# Altium project FET_Driver.PrjPcb (part 1 of 3)
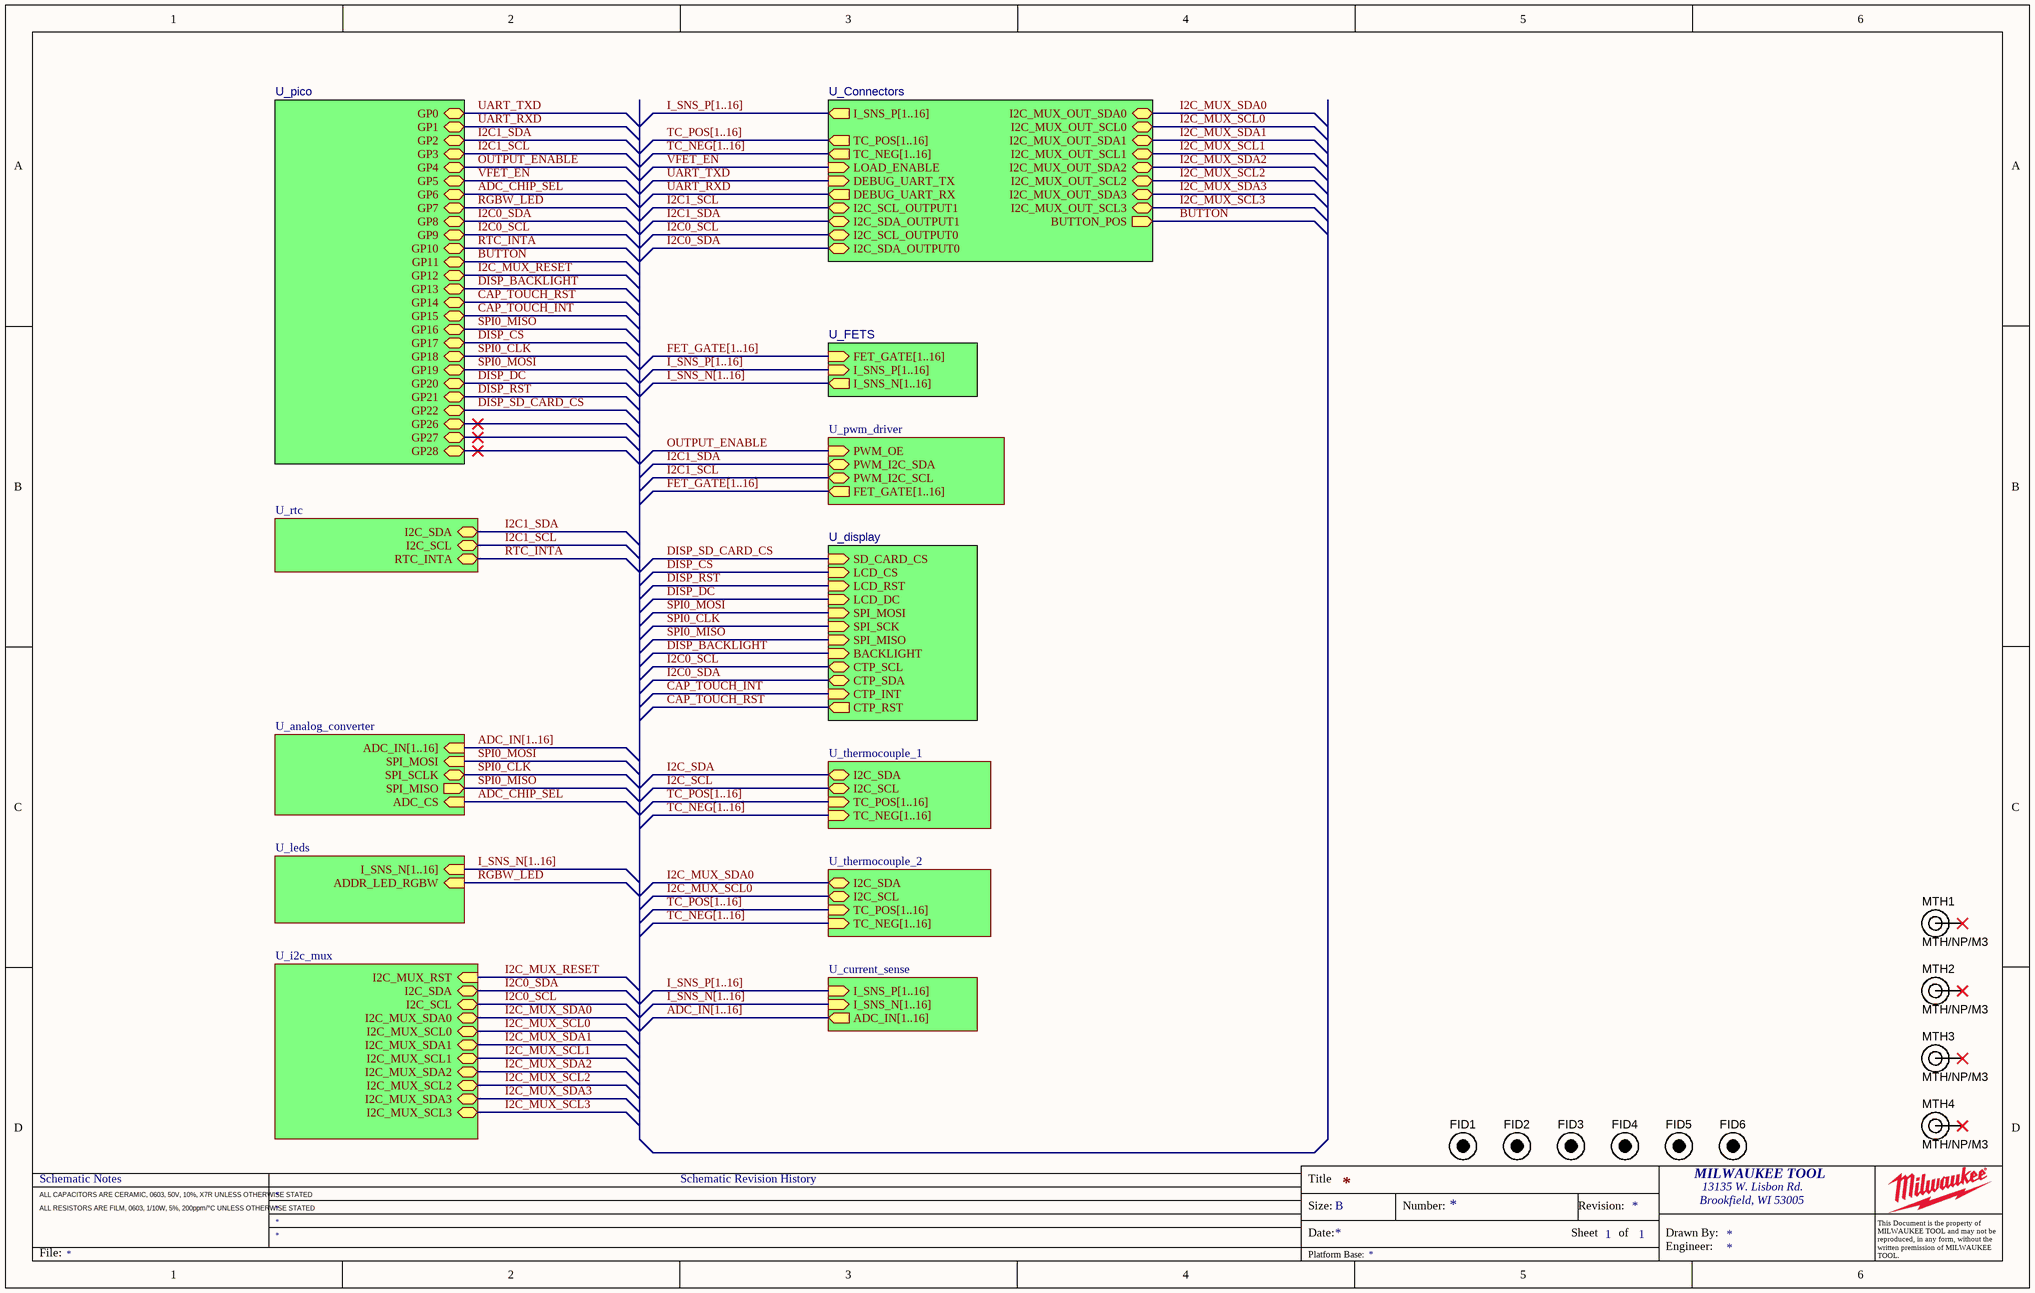
[diagram p0: TopSheet.SchDoc]
projectSheetTotal: sch sheet total; projectName: project name; projectDrawnBy: enter name; projectCreatedDate: enter date; projectApprovedDate: enter date; projectApprovedBy: enter name; pcbRevision: A; pcbNumber: 806xxx; pcbDescriptionLine2: enter description; pcbDescriptionLine1: enter description; pcbDescription: enter description; pcaRevision: A; pcaNumber: 840xxx; pcaDesctiption: enter description; pcaDescriptionLine2: enter description; pcaDescriptionLine1: enter description; bomNotes: -; bomCreatedDate: enter date
13 sheets, 608 parts. Net scope: hierarchical (ports join the sheet entries above them; power ports are global).
Board file: main.PcbDoc
Sheets:
  TopSheet.SchDoc
    U_pico = pico.SchDoc
    U_Connectors = Connectors.SchDoc
    U_leds = leds.SchDoc
    U_i2c_mux = i2c_mux.SchDoc
    U_analog_converter = analog_converter.SchDoc
    U_display = display.SchDoc
    U_thermocouple_1 = thermocouple_1.SchDoc
    U_thermocouple_2 = thermocouple_2.SchDoc
    U_current_sense = current_sense.SchDoc
    U_pwm_driver = pwm_driver.SchDoc
    U_FETS = FETS.SchDoc
    U_rtc = rtc.SchDoc

## Sheet TopSheet.SchDoc
size B; Address1: MILWAUKEE TOOL; Address2: 13135 W. Lisbon Rd.; Address3: Brookfield, WI 53005; SheetNumber: 1; SheetTotal: 1

### Parts
FID1  FIDUCIAL STANDARD  [FID]  (value not drawn)  (no BOM)
FID2  FIDUCIAL STANDARD  [FID]  (value not drawn)  (no BOM)
FID3  FIDUCIAL STANDARD  [FID]  (value not drawn)  (no BOM)
FID4  FIDUCIAL STANDARD  [FID]  (value not drawn)  (no BOM)
FID5  FIDUCIAL STANDARD  [FID]  (value not drawn)  (no BOM)
FID6  FIDUCIAL STANDARD  [FID]  (value not drawn)  (no BOM)
MTH1  MTH/NP/M3  [MTGNP700H325Z700P]  (no BOM)
MTH2  MTH/NP/M3  [MTGNP700H325Z700P]  (no BOM)
MTH3  MTH/NP/M3  [MTGNP700H325Z700P]  (no BOM)
MTH4  MTH/NP/M3  [MTGNP700H325Z700P]  (no BOM)

### Sub-sheets
U_analog_converter = analog_converter.SchDoc: ADC_IN[1..16] (in), SPI_MISO (out), SPI_MOSI (in), SPI_SCLK (bidir), ADC_CS (in)
U_Connectors = Connectors.SchDoc: DEBUG_UART_TX (in), DEBUG_UART_RX (out), I2C_SCL_OUTPUT1 (bidir), I2C_SDA_OUTPUT1 (bidir), LOAD_ENABLE (in), I_SNS_P[1..16] (out), TC_POS[1..16] (out), TC_NEG[1..16] (out), I2C_MUX_OUT_SDA0 (bidir), I2C_MUX_OUT_SCL0 (bidir), I2C_MUX_OUT_SDA1 (bidir), I2C_MUX_OUT_SCL1 (bidir), I2C_MUX_OUT_SDA2 (bidir), I2C_MUX_OUT_SCL2 (bidir), I2C_MUX_OUT_SDA3 (bidir), I2C_MUX_OUT_SCL3 (bidir), BUTTON_POS (out), I2C_SDA_OUTPUT0 (bidir), I2C_SCL_OUTPUT0 (bidir)
U_current_sense = current_sense.SchDoc: ADC_IN[1..16] (out), I_SNS_P[1..16] (in), I_SNS_N[1..16] (in)
U_display = display.SchDoc: LCD_CS (in), LCD_RST (in), LCD_DC (in), SPI_MOSI (in), SPI_SCK (in), BACKLIGHT (in), SPI_MISO (in), CTP_SCL (bidir), CTP_RST (out), CTP_SDA (bidir), CTP_INT (in), SD_CARD_CS (in)
U_FETS = FETS.SchDoc: FET_GATE[1..16] (in), I_SNS_N[1..16] (out), I_SNS_P[1..16] (in)
U_i2c_mux = i2c_mux.SchDoc: I2C_SDA (bidir), I2C_SCL (bidir), I2C_MUX_SDA0 (bidir), I2C_MUX_SDA1 (bidir), I2C_MUX_SDA2 (bidir), I2C_MUX_SDA3 (bidir), I2C_MUX_SCL0 (bidir), I2C_MUX_SCL1 (bidir), I2C_MUX_SCL2 (bidir), I2C_MUX_SCL3 (bidir), I2C_MUX_RST (in)
U_leds = leds.SchDoc: I_SNS_N[1..16] (in), ADDR_LED_RGBW (in)
U_pico = pico.SchDoc: GP0 (bidir), GP1 (bidir), GP2 (bidir), GP3 (bidir), GP4 (bidir), GP5 (bidir), GP6 (bidir), GP7 (bidir), GP8 (bidir), GP9 (bidir), GP10 (bidir), GP11 (bidir), GP12 (bidir), GP13 (bidir), GP14 (bidir), GP15 (bidir), GP16 (bidir), GP17 (bidir), GP18 (bidir), GP19 (bidir), GP20 (bidir), GP21 (bidir), GP22 (bidir), GP26 (bidir), GP27 (bidir), GP28 (bidir)
U_pwm_driver = pwm_driver.SchDoc: PWM_OE (in), PWM_I2C_SDA (bidir), PWM_I2C_SCL (bidir), FET_GATE[1..16] (out)
U_rtc = rtc.SchDoc: I2C_SDA (bidir), I2C_SCL (bidir), RTC_INTA (bidir)
U_thermocouple_1 = thermocouple_1.SchDoc: I2C_SDA (bidir), I2C_SCL (bidir), TC_POS[1..16] (in), TC_NEG[1..16] (in)
U_thermocouple_2 = thermocouple_2.SchDoc: I2C_SDA (bidir), I2C_SCL (bidir), TC_POS[1..16] (in), TC_NEG[1..16] (in)

### Nets
ADC_CHIP_SEL: sheet U_pico/GP6, sheet U_analog_converter/ADC_CS
BUTTON: sheet U_pico/GP11, sheet U_Connectors/BUTTON_POS
CAP_TOUCH_INT: sheet U_pico/GP15, sheet U_display/CTP_INT
CAP_TOUCH_RST: sheet U_pico/GP14, sheet U_display/CTP_RST
DISP_BACKLIGHT: sheet U_pico/GP13, sheet U_display/BACKLIGHT
DISP_CS: sheet U_pico/GP17, sheet U_display/LCD_CS
DISP_DC: sheet U_pico/GP20, sheet U_display/LCD_DC
DISP_RST: sheet U_pico/GP21, sheet U_display/LCD_RST
DISP_SD_CARD_CS: sheet U_pico/GP22, sheet U_display/SD_CARD_CS
I2C0_SCL: sheet U_pico/GP9, sheet U_Connectors/I2C_SCL_OUTPUT0, sheet U_i2c_mux/I2C_SCL, sheet U_display/CTP_SCL
I2C0_SDA: sheet U_pico/GP8, sheet U_Connectors/I2C_SDA_OUTPUT0, sheet U_i2c_mux/I2C_SDA, sheet U_display/CTP_SDA
I2C1_SCL: sheet U_pico/GP3, sheet U_Connectors/I2C_SCL_OUTPUT1, sheet U_pwm_driver/PWM_I2C_SCL, sheet U_rtc/I2C_SCL
I2C1_SDA: sheet U_pico/GP2, sheet U_Connectors/I2C_SDA_OUTPUT1, sheet U_pwm_driver/PWM_I2C_SDA, sheet U_rtc/I2C_SDA
I2C_MUX_RESET: sheet U_pico/GP12, sheet U_i2c_mux/I2C_MUX_RST
I2C_MUX_SCL0: sheet U_Connectors/I2C_MUX_OUT_SCL0, sheet U_i2c_mux/I2C_MUX_SCL0, sheet U_thermocouple_2/I2C_SCL
I2C_MUX_SCL1: sheet U_Connectors/I2C_MUX_OUT_SCL1, sheet U_i2c_mux/I2C_MUX_SCL1
I2C_MUX_SCL2: sheet U_Connectors/I2C_MUX_OUT_SCL2, sheet U_i2c_mux/I2C_MUX_SCL2
I2C_MUX_SCL3: sheet U_Connectors/I2C_MUX_OUT_SCL3, sheet U_i2c_mux/I2C_MUX_SCL3
I2C_MUX_SDA0: sheet U_Connectors/I2C_MUX_OUT_SDA0, sheet U_i2c_mux/I2C_MUX_SDA0, sheet U_thermocouple_2/I2C_SDA
I2C_MUX_SDA1: sheet U_Connectors/I2C_MUX_OUT_SDA1, sheet U_i2c_mux/I2C_MUX_SDA1
I2C_MUX_SDA2: sheet U_Connectors/I2C_MUX_OUT_SDA2, sheet U_i2c_mux/I2C_MUX_SDA2
I2C_MUX_SDA3: sheet U_Connectors/I2C_MUX_OUT_SDA3, sheet U_i2c_mux/I2C_MUX_SDA3
OUTPUT_ENABLE: sheet U_pico/GP4, sheet U_pwm_driver/PWM_OE
RGBW_LED: sheet U_pico/GP7, sheet U_leds/ADDR_LED_RGBW
RTC_INTA: sheet U_pico/GP10, sheet U_rtc/RTC_INTA
SPI0_CLK: sheet U_pico/GP18, sheet U_analog_converter/SPI_SCLK, sheet U_display/SPI_SCK
SPI0_MISO: sheet U_pico/GP16, sheet U_analog_converter/SPI_MISO, sheet U_display/SPI_MISO
SPI0_MOSI: sheet U_pico/GP19, sheet U_analog_converter/SPI_MOSI, sheet U_display/SPI_MOSI
UART_RXD: sheet U_pico/GP1, sheet U_Connectors/DEBUG_UART_RX
UART_TXD: sheet U_pico/GP0, sheet U_Connectors/DEBUG_UART_TX
VFET_EN: sheet U_pico/GP5, sheet U_Connectors/LOAD_ENABLE

Not connected (* = marked no-connect by the designer): MTH1 1*; MTH2 1*; MTH3 1*; MTH4 1*

### Buses and harness runs
bus ADC_IN[1..16] = sheet U_analog_converter/ADC_IN[1..16]
bus ADC_IN[1..16] = sheet U_current_sense/ADC_IN[1..16]
bus FET_GATE[1..16] = sheet U_FETS/FET_GATE[1..16]
bus FET_GATE[1..16] = sheet U_pwm_driver/FET_GATE[1..16]
bus I_SNS_N[1..16] = sheet U_current_sense/I_SNS_N[1..16]
bus I_SNS_N[1..16] = sheet U_FETS/I_SNS_N[1..16]
bus I_SNS_N[1..16] = sheet U_leds/I_SNS_N[1..16]
bus I_SNS_P[1..16] = sheet U_Connectors/I_SNS_P[1..16]
bus I_SNS_P[1..16] = sheet U_current_sense/I_SNS_P[1..16]
bus I_SNS_P[1..16] = sheet U_FETS/I_SNS_P[1..16]
bus TC_NEG[1..16] = sheet U_Connectors/TC_NEG[1..16]
bus TC_NEG[1..16] = sheet U_thermocouple_1/TC_NEG[1..16]
bus TC_NEG[1..16] = sheet U_thermocouple_2/TC_NEG[1..16]
bus TC_POS[1..16] = sheet U_Connectors/TC_POS[1..16]
bus TC_POS[1..16] = sheet U_thermocouple_1/TC_POS[1..16]
bus TC_POS[1..16] = sheet U_thermocouple_2/TC_POS[1..16]

### Notes on the sheet
- Schematic Notes
- Schematic Revision History
- Title
- ALL CAPACITORS ARE CERAMIC, 0603, 50V, 10%, X7R UNLESS OTHERWISE STATED
- ALL RESISTORS ARE FILM, 0603, 1/10W, 5%, 200ppm/°C UNLESS OTHERWISE STATED
- Size:
- Date:
- B
- Number:
- Sheet
- Revision:
- of
- Drawn By:
- Brookfield, WI 53005
- File:
- Platform Base:
- Engineer:
- This Document is the property of MILWAUKEE TOOL and may not be reproduced, in any form, without the written premission of MILWAUKEE TOOL.

### Library data of the parts
FID1-FID6 = CMP-019-0003: STANDARD PCB FIDUCIAL; Populate: DNP; Soldermask Dimensions: 1.3mm; Copper Dimensions: 1mm; Design Item ID: Fiducial, Standard
MTH1-MTH4 = CMP-022-0003: M3 Screw Mounted Hole Non-Plated; Drill size: 3.25mm; Annular Ring Size: 7mm; Bolt Diameter: 3mm; Populate: DNP; Bolt Head Size: 6.3mm; Design Item ID: MTH/NP/M3; ClassName: MTHole

## Sheet pico.SchDoc
size B; Address1: MILWAUKEE TOOL; Address2: 13135 W. Lisbon Rd.; Address3: Brookfield, WI 53005; SheetNumber: 1; SheetTotal: 1
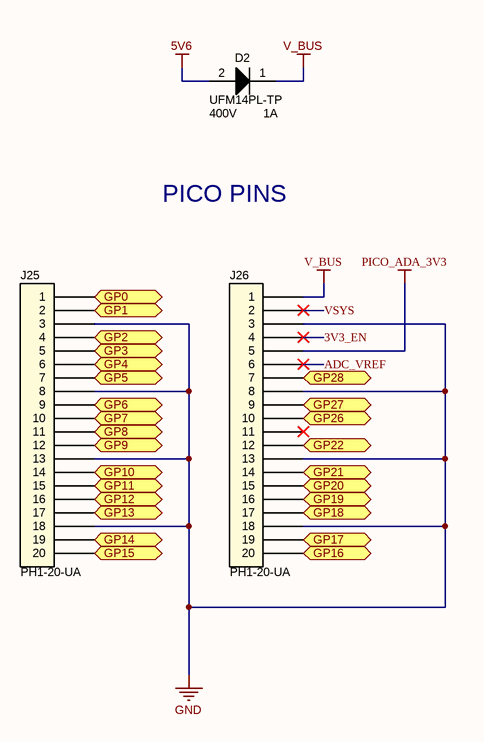
[diagram p1: pico.SchDoc]

### Parts
D2  UFM14PL-TP  Current Rating: 1A  Voltage Rating: 400V  [SODFL358X135-2N]
J25  PH1-20-UA  [CONN_ADAM_TECH_PH1-20-UA]
J26  PH1-20-UA  [CONN_ADAM_TECH_PH1-20-UA]

### Ports
GP0 (bidir), GP1 (bidir), GP2 (bidir), GP3 (bidir), GP4 (bidir), GP5 (bidir), GP6 (bidir), GP7 (bidir), GP8 (bidir), GP9 (bidir), GP10 (bidir), GP11 (bidir), GP12 (bidir), GP13 (bidir), GP14 (bidir), GP15 (bidir), GP16 (bidir), GP17 (bidir), GP18 (bidir), GP19 (bidir), GP20 (bidir), GP21 (bidir), GP22 (bidir), GP26 (bidir), GP27 (bidir), GP28 (bidir)

### Nets
5V6: D2.2(Anode)
GND: J25.3 J25.8 J25.13 J25.18 J26.3 J26.8 J26.13 J26.18
PICO_ADA_3V3: J26.5
V_BUS: D2.1(Cathode) J26.1
3V3_EN: J26.4
ADC_CHIP_SEL: J25.9 ; port GP6
ADC_VREF: J26.6
BUTTON: J25.15 ; port GP11
CAP_TOUCH_INT: J25.20 ; port GP15
CAP_TOUCH_RST: J25.19 ; port GP14
DISP_BACKLIGHT: J25.17 ; port GP13
DISP_CS: J26.19 ; port GP17
DISP_DC: J26.15 ; port GP20
DISP_RST: J26.14 ; port GP21
DISP_SD_CARD_CS: J26.12 ; port GP22
I2C0_SCL: J25.12 ; port GP9
I2C0_SDA: J25.11 ; port GP8
I2C1_SCL: J25.5 ; port GP3
I2C1_SDA: J25.4 ; port GP2
I2C_MUX_RESET: J25.16 ; port GP12
OUTPUT_ENABLE: J25.6 ; port GP4
RGBW_LED: J25.10 ; port GP7
RTC_INTA: J25.14 ; port GP10
SPI0_CLK: J26.17 ; port GP18
SPI0_MISO: J26.20 ; port GP16
SPI0_MOSI: J26.16 ; port GP19
UART_RXD: J25.2 ; port GP1
UART_TXD: J25.1 ; port GP0
VFET_EN: J25.7 ; port GP5
VSYS: J26.2
NetJ26_7: J26.7 ; port GP28
NetJ26_9: J26.9 ; port GP27
NetJ26_10: J26.10 ; port GP26

Not connected (* = marked no-connect by the designer): J26 11*

### Notes on the sheet
- PICO PINS
- Schematic Notes
- Schematic Revision History
- Title
- ALL CAPACITORS ARE CERAMIC, 0603, 50V, 10%, X7R UNLESS OTHERWISE STATED
- ALL RESISTORS ARE FILM, 0603, 1/10W, 5%, 200ppm/°C UNLESS OTHERWISE STATED
- Size:
- Date:
- B
- Number:
- Sheet
- Revision:
- of
- Drawn By:
- Brookfield, WI 53005
- File:
- Platform Base:
- Engineer:
- This Document is the property of MILWAUKEE TOOL and may not be reproduced, in any form, without the written premission of MILWAUKEE TOOL.

### Library data of the parts
D2 = CMP-010-0012: DIODE GEN PURP 400V 1A SOD123FL; MFR: Micro Commercial Co; Voltage, Forward: 1.4V @1A; Rth(j-a): 80 C/W; Current, Reverse Leakage: 50uA @VR=400V,Tj=125C; Temp Range: -65 / +150 C; Wattage: 400mW; Value: UFM14PL; ComponentLink1URL: https://www.mccsemi.com/pdf/Products/UFM11PL-UFM17PL(SOD-123FL).pdf; MFR#: UFM14PL-TP; Design Item ID: D/REC/400V/1A/UFM14PL/SOD123FL; Case/Package: SOD123FL; ComponentLink1Description: Datasheet
J25 J26 = CMP-007-0067: CONN HEADER VERT 20POS 2.54MM GOLD; MFR: Adam Tech; Voltage Rating: 250V AC(RMS)/DC; Durability: 50 mating cycles; Current Rating: 1A; System: Connector; Temp Range: -40 / +105 C; Gender: Male; Value: PH1-20-UA; Orientation: Verticle; Terminal Pitch: 2.54mm; RoHS Compliant: Yes; Design Item ID: CON/20P/2.54mm/2A/PH1-20-UA/Adam Tech; MFR#: PH1-20-UA; Contact Finish: Gold; ComponentLink1Description: Drawing; ComponentLink1URL: https://app.adam-tech.com/products/download/data_sheet/201605/ph1-xx-ua-data-sheet.pdf

## Sheet Connectors.SchDoc
size B; Address1: MILWAUKEE TOOL; Address2: 13135 W. Lisbon Rd.; Address3: Brookfield, WI 53005; SheetNumber: 1; SheetTotal: 1
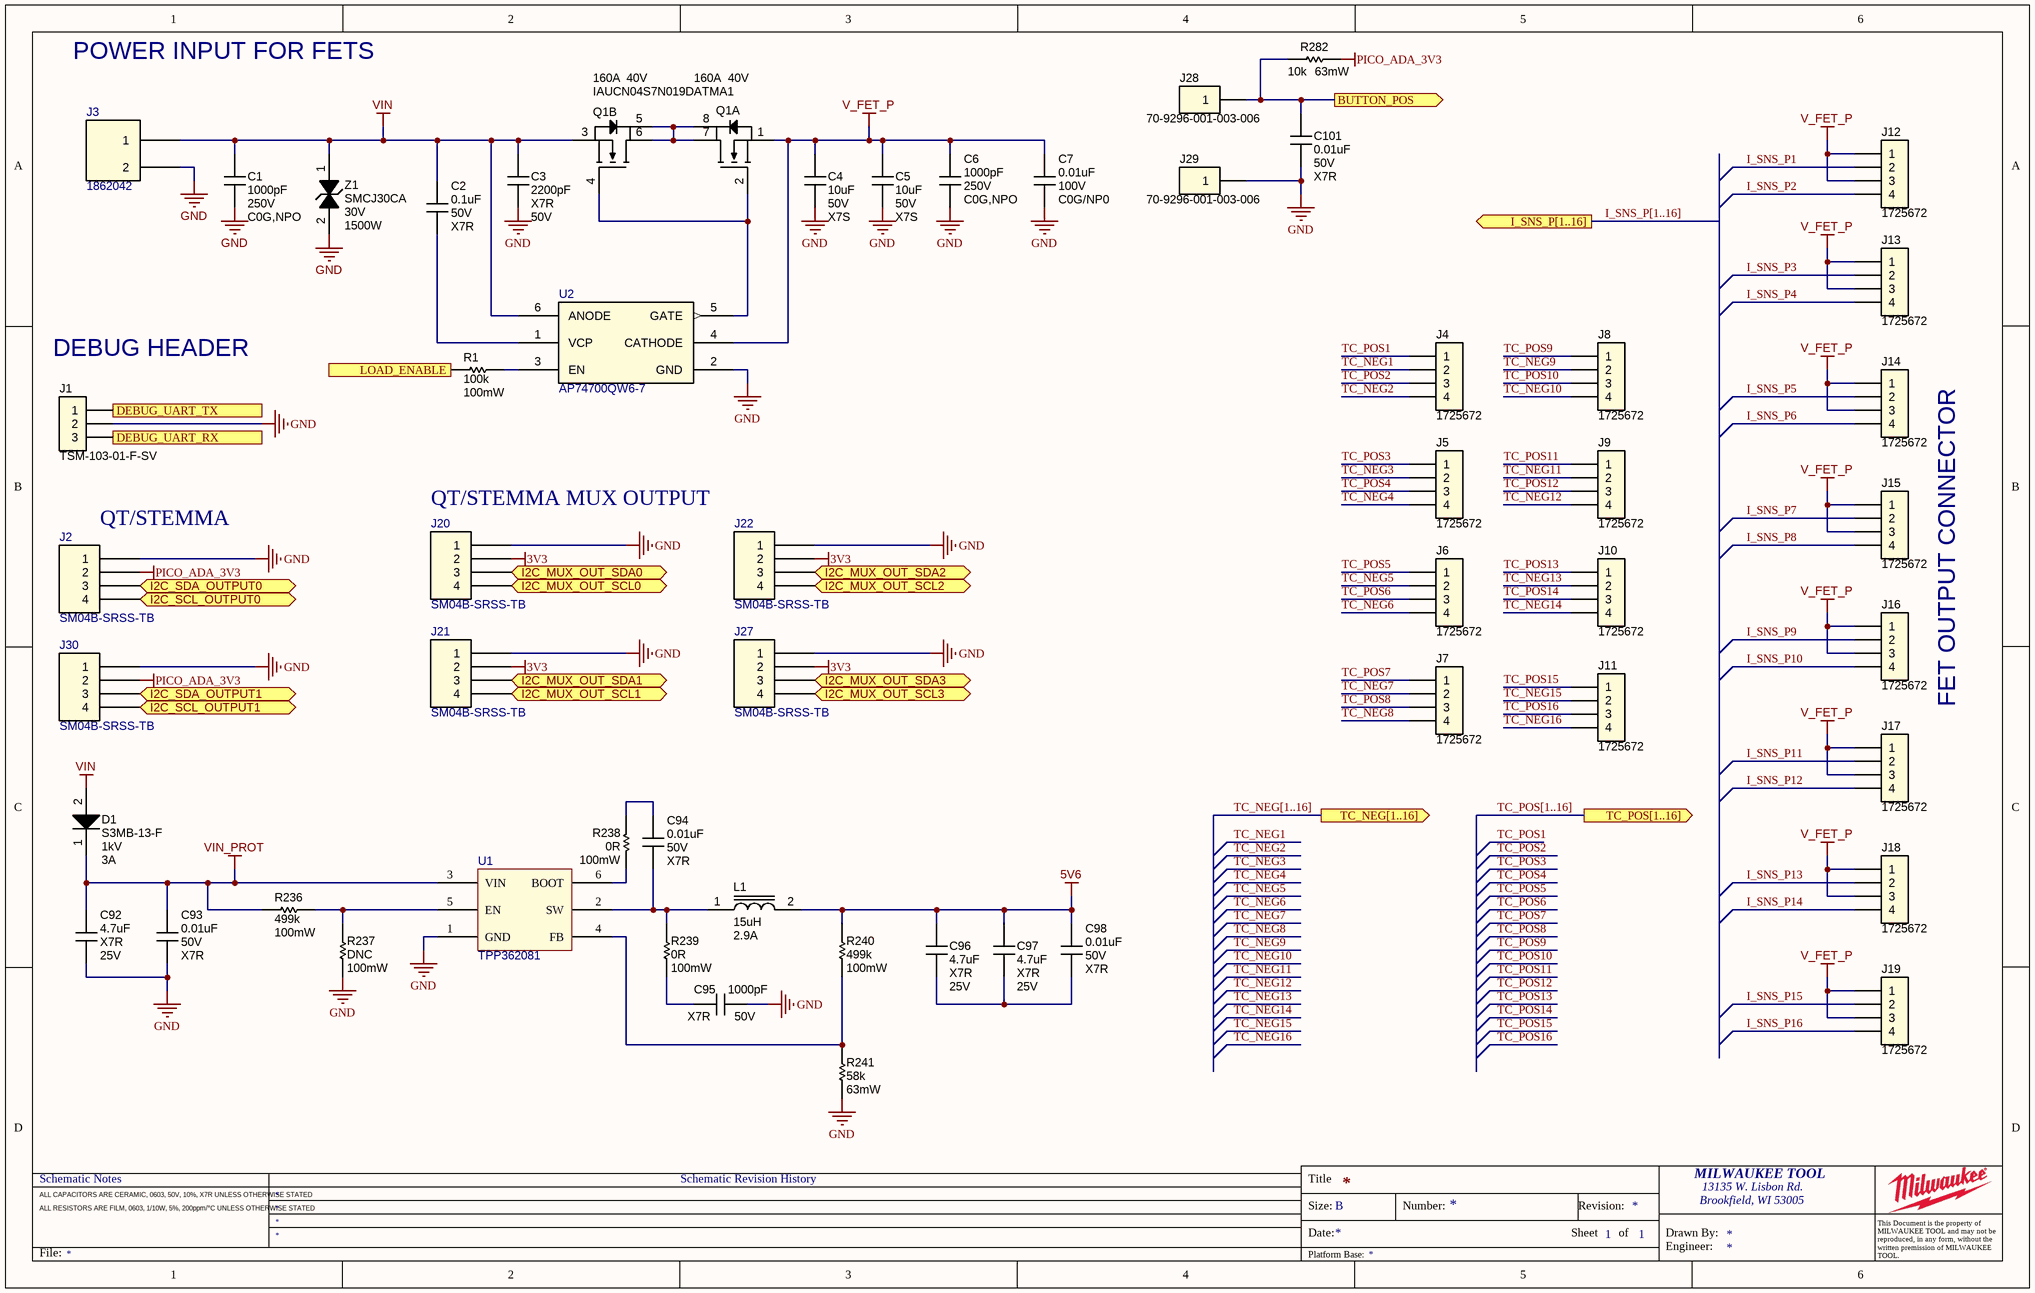
[diagram p2: Connectors.SchDoc]

### Parts
C1  1000pF  Voltage Rating: 250V  Temp Coeff: C0G,NPO  [CAPC1608X09N]
C2  0.1uF  Voltage Rating: 50V  Temp Coeff: X7R  [CAPC1005X06N]
C3  2200pF  Temp Coeff: X7R  Voltage Rating: 50V  [CAPC1608X09N]
C4  10uF  Voltage Rating: 50V  Temp Coeff: X7S  [CAPC3225X28N]
C5  10uF  Voltage Rating: 50V  Temp Coeff: X7S  [CAPC3225X28N]
C6  1000pF  Voltage Rating: 250V  Temp Coeff: C0G,NPO  [CAPC1608X09N]
C7  0.01uF  Voltage Rating: 100V  Temp Coeff: C0G/NP0  [CAPC1608X09N]
C92  4.7uF  Temp Coeff: X7R  Voltage Rating: 25V  [CAPC2012X14N]
C93  0.01uF  Voltage Rating: 50V  Temp Coeff: X7R  [CAPC1608X09N]
C94  0.01uF  Voltage Rating: 50V  Temp Coeff: X7R  [CAPC1608X09N]
C95  1000pF  Temp Coeff: X7R  Voltage Rating: 50V  [CAPC1608X09N]
C96  4.7uF  Temp Coeff: X7R  Voltage Rating: 25V  [CAPC2012X14N]
C97  4.7uF  Temp Coeff: X7R  Voltage Rating: 25V  [CAPC2012X14N]
C98  0.01uF  Voltage Rating: 50V  Temp Coeff: X7R  [CAPC1608X09N]
C101  0.01uF  Voltage Rating: 50V  Temp Coeff: X7R  [CAPC1608X09N]
D1  S3MB-13-F  Voltage Rating: 1kV  Current Rating: 3A  [DIOM4336X25N]
J1  TSM-103-01-F-SV  [CONN_SAMTEC_TSM-103-01-F-SV]
J2  SM04B-SRSS-TB  [CONN_JST_SM04B-SRSS-TB_JST]
J3  1862042  [CONN_PHOENIX_1862042]
J4  1725672  [CONN_PHOENIX_1725672]
J5  1725672  [CONN_PHOENIX_1725672]
J6  1725672  [CONN_PHOENIX_1725672]
J7  1725672  [CONN_PHOENIX_1725672]
J8  1725672  [CONN_PHOENIX_1725672]
J9  1725672  [CONN_PHOENIX_1725672]
J10  1725672  [CONN_PHOENIX_1725672]
J11  1725672  [CONN_PHOENIX_1725672]
J12  1725672  [CONN_PHOENIX_1725672]
J13  1725672  [CONN_PHOENIX_1725672]
J14  1725672  [CONN_PHOENIX_1725672]
J15  1725672  [CONN_PHOENIX_1725672]
J16  1725672  [CONN_PHOENIX_1725672]
J17  1725672  [CONN_PHOENIX_1725672]
J18  1725672  [CONN_PHOENIX_1725672]
J19  1725672  [CONN_PHOENIX_1725672]
J20  SM04B-SRSS-TB  [CONN_JST_SM04B-SRSS-TB_JST]
J21  SM04B-SRSS-TB  [CONN_JST_SM04B-SRSS-TB_JST]
J22  SM04B-SRSS-TB  [CONN_JST_SM04B-SRSS-TB_JST]
J27  SM04B-SRSS-TB  [CONN_JST_SM04B-SRSS-TB_JST]
J28  70-9296-001-003-006  [AVX_709296001003006]
J29  70-9296-001-003-006  [AVX_709296001003006]
J30  SM04B-SRSS-TB  [CONN_JST_SM04B-SRSS-TB_JST]
L1  15uH  Current RAting: 2.9A  [INDM6565X30N]
Q1  Current: 160A  Voltage: 40V  [INF-PG-TDSON-8-61-V]  (hidden comment: IAUCN04S7N019DATMA1)  (parts A,B of 2)
R1  100k  Wattage: 100mW  [RESC1608X06N]
R236  499k  Wattage: 100mW  [RESC1608X06N]
R237  DNC  Wattage: 100mW  [RESC1608X06N]
R238  0R  Wattage: 100mW  [RESC1608X06N]
R239  0R  Wattage: 100mW  [RESC1608X06N]
R240  499k  Wattage: 100mW  [RESC1608X06N]
R241  58k  Wattage: 63mW  [RESC1005X04N]
R282  10k  Wattage: 63mW  [RESC1005X04N]
U1  TPP362081  [SOT95P280X95-6N]
U2  AP74700QW6-7  [SOT95P285X140-6N]
Z1  SMCJ30CA  Voltage: 30V  Wattage: 1500W  [DIOM6959X26N]

### Ports
BUTTON_POS (out), DEBUG_UART_RX (out), DEBUG_UART_TX (in), I2C_MUX_OUT_SCL0 (bidir), I2C_MUX_OUT_SCL1 (bidir), I2C_MUX_OUT_SCL2 (bidir), I2C_MUX_OUT_SCL3 (bidir), I2C_MUX_OUT_SDA0 (bidir), I2C_MUX_OUT_SDA1 (bidir), I2C_MUX_OUT_SDA2 (bidir), I2C_MUX_OUT_SDA3 (bidir), I2C_SCL_OUTPUT0 (bidir), I2C_SCL_OUTPUT1 (bidir), I2C_SDA_OUTPUT0 (bidir), I2C_SDA_OUTPUT1 (bidir), I_SNS_P[1..16] (out), LOAD_ENABLE (in), TC_NEG[1..16] (out), TC_POS[1..16] (out)

### Nets
3V3: J20.2 J21.2 J22.2 J27.2
5V6: C96.1 C97.1 C98.2 L1.2 R240.2
GND: C1.2 C3.2 C4.2 C5.2 C6.2 C7.2 C92.2 C93.1 C95.2 C101.1 J1.2 J2.1 J3.2 J20.1 J21.1 J22.1 J27.1 J29.1 J30.1 R237.2 R241.1 U1.1(GND) U2.2(GND) Z1.2(A)
PICO_ADA_3V3: J2.2 J30.2 R282.2
V_FET_P: C4.1 C5.1 C6.1 C7.1 J12.1 J12.3 J13.1 J13.3 J14.1 J14.3 J15.1 J15.3 J16.1 J16.3 J17.1 J17.3 J18.1 J18.3 J19.1 J19.3 Q1.1(S) U2.4(CATHODE)
VIN: C1.1 C2.1 C3.1 D1.2(Anode) J3.1 Q1.3(S) U2.6(ANODE) Z1.1(K)
VIN_PROT: C92.1 C93.2 D1.1(Cathode) R236.1 U1.3(VIN)
BUTTON: C101.2 J28.1 R282.1 ; port BUTTON_POS
I2C0_SCL: J2.4 ; port I2C_SCL_OUTPUT0
I2C0_SDA: J2.3 ; port I2C_SDA_OUTPUT0
I2C1_SCL: J30.4 ; port I2C_SCL_OUTPUT1
I2C1_SDA: J30.3 ; port I2C_SDA_OUTPUT1
I2C_MUX_SCL0: J20.4 ; port I2C_MUX_OUT_SCL0
I2C_MUX_SCL1: J21.4 ; port I2C_MUX_OUT_SCL1
I2C_MUX_SCL2: J22.4 ; port I2C_MUX_OUT_SCL2
I2C_MUX_SCL3: J27.4 ; port I2C_MUX_OUT_SCL3
I2C_MUX_SDA0: J20.3 ; port I2C_MUX_OUT_SDA0
I2C_MUX_SDA1: J21.3 ; port I2C_MUX_OUT_SDA1
I2C_MUX_SDA2: J22.3 ; port I2C_MUX_OUT_SDA2
I2C_MUX_SDA3: J27.3 ; port I2C_MUX_OUT_SDA3
I_SNS_P1: J12.2
I_SNS_P2: J12.4
I_SNS_P3: J13.2
I_SNS_P4: J13.4
I_SNS_P5: J14.2
I_SNS_P6: J14.4
I_SNS_P7: J15.2
I_SNS_P8: J15.4
I_SNS_P9: J16.2
I_SNS_P10: J16.4
I_SNS_P11: J17.2
I_SNS_P12: J17.4
I_SNS_P13: J18.2
I_SNS_P14: J18.4
I_SNS_P15: J19.2
I_SNS_P16: J19.4
TC_NEG1: J4.2
TC_NEG2: J4.4
TC_NEG3: J5.2
TC_NEG4: J5.4
TC_NEG5: J6.2
TC_NEG6: J6.4
TC_NEG7: J7.2
TC_NEG8: J7.4
TC_NEG9: J8.2
TC_NEG10: J8.4
TC_NEG11: J9.2
TC_NEG12: J9.4
TC_NEG13: J10.2
TC_NEG14: J10.4
TC_NEG15: J11.2
TC_NEG16: J11.4
TC_POS1: J4.1
TC_POS2: J4.3
TC_POS3: J5.1
TC_POS4: J5.3
TC_POS5: J6.1
TC_POS6: J6.3
TC_POS7: J7.1
TC_POS8: J7.3
TC_POS9: J8.1
TC_POS10: J8.3
TC_POS11: J9.1
TC_POS12: J9.3
TC_POS13: J10.1
TC_POS14: J10.3
TC_POS15: J11.1
TC_POS16: J11.3
UART_RXD: J1.3 ; port DEBUG_UART_RX
UART_TXD: J1.1 ; port DEBUG_UART_TX
VFET_EN: R1.2 ; port LOAD_ENABLE
NetC2_2: C2.2 U2.1(VCP)
NetC94_1: C94.1 L1.1 R239.2 U1.2(SW)
NetC94_2: C94.2 R238.1
NetC95_1: C95.1 R239.1
NetC96_2: C96.2 C97.2 C98.1
NetQ1_2: Q1.2(G) Q1.4(G) U2.5(GATE)
NetQ1_5: Q1.5(D) Q1.6(D) Q1.7(D) Q1.8(D)
NetR1_1: R1.1 U2.3(EN)
NetR236_2: R236.2 R237.1 U1.5(EN)
NetR238_2: R238.2 U1.6(BOOT)
NetR240_1: R240.1 R241.2 U1.4(FB)

### Buses and harness runs
bus I_SNS_P[1..16] = port I_SNS_P[1..16]
bus TC_NEG[1..16] = port TC_NEG[1..16]
bus TC_POS[1..16] = port TC_POS[1..16]

### Notes on the sheet
- POWER INPUT FOR FETS
- (near J1) DEBUG HEADER
- (near J20) QT/STEMMA MUX OUTPUT
- (near J2) QT/STEMMA
- FET OUTPUT CONNECTOR
- Schematic Notes
- Schematic Revision History
- Title
- ALL CAPACITORS ARE CERAMIC, 0603, 50V, 10%, X7R UNLESS OTHERWISE STATED
- ALL RESISTORS ARE FILM, 0603, 1/10W, 5%, 200ppm/°C UNLESS OTHERWISE STATED
- Size:
- Date:
- B
- Number:
- Sheet
- Revision:
- of
- Drawn By:
- Brookfield, WI 53005
- File:
- Platform Base:
- Engineer:
- This Document is the property of MILWAUKEE TOOL and may not be reproduced, in any form, without the written premission of MILWAUKEE TOOL.

### Library data of the parts
C1 C6 = CMP-004-0013: CAP CER 1000PF 250V X7R 0603; MFR2#: C1608C0G2E102J080AA; MFR: KEMET; MFR#: C0603C102JAGAC7867; Tolerance: 5%; Capacitor Type: Ceramic; Temp Range: -55 / +125 C; Case Code (Imperial): 0603; Value: 1000pF; ComponentLink1Description: Datasheet; ComponentLink1URL: https://api.kemet.com/component-edge/download/datasheet/C0603C102K1RAC7411.pdf; RoHS Compliant: Yes; Design Item ID: CN/1000PF/250V/C0G,NPO/5%/0603; MFR2: TDK Corporation; REACH SVHC: Yes; Case Code (Metric): 1608
C2 = CMP-004-0076: CAP CER SMD 0.1UF 50V X7R 0402; MFR3#: KGM05CR71H104KH; MFR#: GRM155R71H104KE14D; MFR: Murata Electronics; MFR4#: CL05B104KB54PNC; MFR2#: C1005X7R1H104K050BB; Tolerance: 10%; Populate: Yes; Temp Range: -55 / +125 C; Capacitor Type: Ceramic; Case Code (Imperial): 0402; Value: 0.1uF; MFR4: Samsung Electro-Mechanics; Design Item ID: CN/0.1uF/50V/X7R/10%/0402; Case Code (Metric): 1005; ComponentLink1URL: https://search.murata.co.jp/Ceramy/image/img/A01X/G101/ENG/GRM155R71H104KE14-01.pdf; MFR3: KYOCERA AVX; MFR2: TDK Corporation; ComponentLink1Description: Datasheet; RoHS Compliant: Yes; Part Status: Production
C3 = CMP-004-0009: CAP CER 2200PF 50V X7R 0603; MFR2#: CL10B222KB8NFNC; MFR: KEMET; MFR#: C0603C222K5RACAUTO; Tolerance: 10%; Quality: AEC-Q200; Temp Range: -55 / +125 C; Capacitor Type: Ceramic; MFR2: Samsung Electro-Mechanics; Case Code (Metric): 1608; ComponentLink1Description: Datasheet; Value: 2200pF; REACH SVHC: Yes; Case Code (Imperial): 0603; RoHS Compliant: Yes; Design Item ID: CN/2200pF/50V/X7R/10%/0603; ComponentLink1URL: https://api.kemet.com/component-edge/download/datasheet/C0603C473K5RACTU.pdf
C4 C5 = CMP-004-0001: CAP, CER, 10µF, 50V, 10%, X7S, 1210; MFR: TDK Corporation; MFR#: CGA6P3X7S1H106K250AE; Temp Range: -55 / +125 C; Quality: AEC-Q200; Capacitor Type: Ceramic; Design Item ID: CN/10uF/50V/X7S/10%/1210; Case Code (Imperial): 1210; ComponentLink1URL: https://product.tdk.com/info/en/catalog/datasheets/mlcc_automotive_soft_en.pdf?ref_disty=digikey; Case Code (Metric): 3225; ComponentLink1Description: Datasheet; Tolerance: 10%; Value: 10uF; Supplier 1: Avnet; Supplier Part Number 1: CGA6P3X7S1H106K250AE
C7 = CMP-004-0027: CAP CER 1000PF 100V C0G/NP0 0603; MFR: Murata Electronics; MFR#: GCM1885C2A102JA16D; MFR2#: C0603C103K2RECAUTO; Tolerance: 10%; Temp Range: -55 / +125 C; Capacitor Type: Ceramic; RoHS Compliant: Yes; Case Code (Metric): 1608; REACH SVHC: Yes; MFR2: TDK Corporation; Value: 0.01uF; Case Code (Imperial): 0603; Design Item ID: CN/0.01uF/100V/C0G,NP0/10%/0603
C92 C96 C97 = CMP-004-0011: CAP CER 4.7UF 25V X7R 0805; MFR: TDK Corporation; MFR3#: 0805B475K500NT; MFR#: C2012X7R1E475K125AE; MFR2#: CL21B475KAFNNNE; Temp Range: -55 / +125 C; Tolerance: 10%; Capacitor Type: Ceramic; MFR2: Samsung Electro-Mechanics; Case Code (Metric): 2012; REACH SVHC: Yes; ComponentLink1URL: https://search.murata.co.jp/Ceramy/image/img/A01X/G101/ENG/GRM32EC72A106KE05-01.pdf; MFR3: FengHua; Design Item ID: CN/4.7uF/25V/X7R/10%/0805; Value: 4.7uF; RoHS Compliant: Yes; ComponentLink1Description: Datasheet; Case Code (Imperial): 0805
C93 C94 C98 C101 = CMP-004-0069: CAP CER 10000PF (0.01uF) 50V X7R 0603; MFR2#: C0603C103K5RAC7411; MFR#: 06035C103KAT2A; MFR: KYOCERA AVX; Tolerance: 10%; Capacitor Type: Ceramic; Temp Range: -55 / +125 C; Value: 0.01uF; MFR2: KEMET; Case Code (Metric): 1608; Design Item ID: CN/0.01uF/50V/X7R/10%/0603; Case Code (Imperial): 0603; Part Status: Production; Lead Free: *; REACH SVHC: *
C95 = CMP-004-0050: CAP CER 1000PF 50V X7R 0603; MFR: Yageo; MFR2#: 06035C102KAT2A; MFR#: CC0603KRX7R9BB102; Capacitor Type: Ceramic; Temp Range: -55 / +125 C; Tolerance: 10%; Case Code (Metric): 1608; Value: 1000pF; ComponentLink1URL: https://www.yageo.com/upload/media/product/productsearch/datasheet/mlcc/UPY-GPHC_X7R_6.3V-to-50V_18.pdf; Case Code (Imperial): 0603; MFR2: AVX Corporation; ComponentLink1Description: Datasheet; Design Item ID: CN/1000PF/50V/X7R/10%/0603
D1 = CMP-010-0001: DIODE GEN PURP 1KV 3A SMB; MFR: Diodes Incorporated; Current, Non-rep Pk Forward: 100A; Current, Reverse Leakage: 250uA @125 C; Voltage, Forward: 1.15V; Temp Range: -65 / 150 C; Voltage, RMS Max: 700V; Rth(j-c): 10 C/W; MFR#: S3MB-13-F; Value: S3MB-13-F; REACH SVHC: No SVHC; Design Item ID: D/REC/1000V/3A/S3MB-13-F/SMB; RoHS Compliant: Yes
J1 = CMP-007-0021: CONN HEADER SMD 3POS 2.54MM; MFR: Samtec; Gender: Male; Voltage Rating: 475V; Temp Range: -55 / +125 C; Current Rating: 4.1A; System: Connector; Number of Contacts: 3; RoHS Compliant: Yes; Lead Free: Lead Free; Orientation: Straight; Contact Finish: Gold; Flammability Rating: UL94V-0; ComponentLink1URL: https://suddendocs.samtec.com/catalog_english/tsm.pdf; ComponentLink1Description: Catalog Page; Design Item ID: CON/3P/2.54mm/4.1A/TSM-103-01-F-SV/SAMTEC; Terminal Pitch: 2.54mm; MFR#: TSM-103-01-F-SV; Value: TSM-103-01-F-SV
J2 J20-J22 J27 J30 = CMP-007-0084: CONN HEADER SMD R/A SH 4POS 1MM; MFR: JST; Value: SM04B-SRSS-TB; MFR#: SM04B-SRSS-TB; ComponentLink1URL: https://www.jst-mfg.com/product/pdf/eng/eSH.pdf; ComponentLink1Description: Datasheet; Contact Finish: Tin; Type: Connector; Design Item ID: CON/2P/1MM/1A/SM04B-SRSS-TB/JST
J3 = CMP-007-0077: TERM BLOCK 2POS 45DEG 3.5MM PCB; MFR: Phoenix; Value: 1862042; MFR#: 1862042; ComponentLink1URL: https://www.phoenixcontact.com/us/products/1862042/pdf; ComponentLink1Description: Datasheet; Contact Finish: Tin; Type: Connector; Design Item ID: CON/2P/3.5MM/1862042/PHOENIX
J4-J19 = CMP-007-0053: TERM BLK 4P SIDE ENT 2.54MM PCB; MFR: Phoenix Contact; Voltage Rating: 250V AC(RMS)/DC; Current Rating: 6A; System: Connector; Temp Range: -40 / +115 C; Gender: Male; Value: 1725672; Orientation: Right Angle; Terminal Pitch: 2.54mm; Design Item ID: CON/4P/2.54mm/6A/1725672/PHOENIX_CONTACT; Flammability Rating: UL 94V0; MFR#: 1725672; Contact Finish: Tin; ComponentLink1Description: Datasheet; ComponentLink1URL: https://www.phoenixcontact.com/en-us/products/printed-circuit-board-terminal-mpt-05-4-254-1725672
J28 J29 = CMP-007-0008: CONN SSL POKE-IN CONT 18-26AWG; MFR: AVX; System: Connector; Value: 709296001003006; Voltage Rating: 300V; Temp Range: -40 / +125 C; Current Rating: 15A - 7A (18-26AWG); Gender: Female; Design Item ID: CON/1P/POKE/15A-70-9296-001-003-006/AVX; ComponentLink1URL: https://datasheets.avx.com/Poke_Home_Single_70-9296.pdf; Part Status: Production; Orientation: Right Angle; ComponentLink1Description: Datasheet; Terminal Pitch: n/a; MFR#: 709296001003006; Wire Gauge: 18 - 26 AWG
L1 = CMP-018-0005: FIXED IND 15UH 2.9A 127 MOHM SMD; MFR: Vishay Dale; MFR#: IHLP2525CZER150M8A; Current, Saturation: 2.8A; Inductor Type: GENERAL PURPOSE INDUCTOR; Voltage Rating: 75V; DCR: 127 mOhm MAX; Quality: AEC-Q200; Self Resonant Frequency: 11 MHz; Temp Range: -55 / +180 C; Tolerance: 20%; Value: 15uH; Design Item ID: L/15uH/127/2.9A/20%/IHLP2525CZ; ComponentLink1URL: https://www.vishay.com/docs/34362/lp25cz8a.pdf; RoHS Compliant: Yes; ComponentLink1Description: Datasheet; REACH SVHC: Yes
Q1 = CMP-029-0048: TRANS DUAL MOSFET N-CH 40V 160A PG-TDSON-8-60; MFR: Infineon; Rth(j-c): 1.6 C/W; Wattage: 96W; Rth(j-a): 46 C/W; Transistor Type: NCH; Populate: Yes; Temp Range, Junction: -55 / +175 C; Design Item ID: Q/NCH/D/40V/160A/IAUCN04S7N019DATMA1/8tdson; MFR#: IAUCN04S7N019DATMA1; Case/Package: PG-TDSON-8; REACH SVHC: No SVHC; Value: IAUCN04S7N019DATMA1; RoHS Compliant: Yes; Part Status: Production; ComponentLink1URL: https://www.infineon.com/assets/row/public/documents/10/49/infineon-iaucn04s7n019d-datasheet-en.pdf?fileId=8ac78c8c92416ca501927583b6c81041; ComponentLink1Description: Datasheet; Temp Range, Ambient: -55 / +175 C
R1 = CMP-025-0099: RES SMD 100K OHM 1% 1/10W 0603; MFR3#: CRGCQ0603F100K; MFR: Panasonic Electronic Components; MFR4#: RS-03K1003FT; MFR#: ERJ-3EKF1003V; MFR2#: RMCF0603FT100K; Voltage: 75V; Temp Range: -55 / +155 C; Quality: AEC-Q200; Current: 1A; Value: 100k; Resistor Type: Thick Film; ComponentLink1URL: https://industrial.panasonic.com/cdbs/www-data/pdf/RDA0000/AOA0000C304.pdf; ComponentLink1Description: Datasheet; Tolerance: 1%; Case Code (Metric): 1608; MFR4: FengHua; MFR3: TE Connectivity; Design Item ID: R/100.0K/0.1W/1%/0603; Case Code (Imperial): 0603; MFR2: Stackpole Electronics Inc
R236 R240 = CMP-025-0006: RES SMD 499k OHM 1% 1/10W 0603; MFR: Panasonic Electronic Components; MFR#: ERJ-3EKF4993V; MFR2#: RMCF0603FT499K; Voltage Rating: 75V; Quality: AEC-Q200; Current: 1A; Temp Range: -55 / +155 C; Temperature Coefficient: 100ppm/°C; MFR2: Stackpole Electronics Inc; ComponentLink1URL: https://industrial.panasonic.com/cdbs/www-data/pdf/RDA0000/AOA0000C304.pdf; Value: 499k Ohm; Resistor Type: Thick Film; Case Code (Metric): 1608; REACH SVHC: Yes; Design Item ID: R/499K/0.1W/1%/0603; ComponentLink1Description: Datasheet; Case Code (Imperial): 0603; Tolerance: 1%; RoHS Compliant: Yes
R237-R239 = CMP-025-0103: RES SMD 0 OHM JUMPER 1/10W 0603; MFR#: ERJ-3GEY0R00V; MFR2#: RMCF0603ZT0R00; MFR: Panasonic Electronic Components; MFR3#: RK73Z1JTBK; MFR4#: RC0603JR-070RL; Voltage: 75V; Value: 0 ohm; Current: 1A; Quality: AEC-Q200; Temp Range: -55 / +155 C; MFR4: YAGEO; ComponentLink1Description: Datasheet; MFR3: KOA Speer Electronics; RoHS Compliant: Yes; ComponentLink1URL: https://industrial.panasonic.com/cdbs/www-data/pdf/RDA0000/AOA0000C301.pdf; Tolerance: Jumper; Resistor Type: Thick Film; Design Item ID: R/0.00/0.1W/JUMPER/0603; MFR2: Stackpole Electronics Inc
R241 = CMP-025-0175: RES SMD 58K OHM 1% 1/16W 0402; MFR#: RC0402FR-0759KL; MFR: Yageo; Value: 58k Ohm; Temp Range: -55 / +155 C; Temperature Coefficient: 50 ppm/°C; Populate: Yes; Tolerance: 1%; ComponentLink1Description: Datasheet; ComponentLink1URL: https://yageogroup.com/content/datasheet/asset/file/PYU-RC_GROUP_51_ROHS_L; Resistor Type: Thick Film; Case Code (Imperial): 0402; Case Code (Metric): 1005; Design Item ID: R/58K/0.063W/1%/0402; RoHS Compliant: Yes; Part Status: Production
R282 = CMP-025-0026: RES SMD 10K OHM 0.5% 1/16W 0402; MFR2#: RNCF0402DTE10K0; MFR#: ERA-2AED103X; MFR: Panasonic Electronic Components; Temp Range: -55 / +155 C; Voltage Rating: 50V; Temperature Coefficient: 25ppm/°C; Quality: AEC-Q200; MFR2: Stackpole Electronics Inc; RoHS Compliant: Yes; ComponentLink1Description: Datasheet; REACH SVHC: Yes; Value: 10k; Case Code (Imperial): 0402; Case Code (Metric): 1005; Tolerance: 0.5%; Resistor Type: Thick Film; Design Item ID: R/10.0K/0.063W/0.5%/0402; ComponentLink1URL: https://industrial.panasonic.com/cdbs/www-data/pdf/RDM0000/AOA0000C307.pdf
U1 = CMP-017-0119: IC OPAMP VFB 1 CIRCUIT 8HVSSOP; MFR: 3PEAK; MFR#: TPP362081-T6TR; Populate: Yes; REACFH SVCH: Unaffected; Temp Range, Ambient: -40 / +85 C; Voltage Range, Input: 4.5V - 36V DC; Temp Range, Junction: -40 / +150C; Voltage Rating, Output: 0.6V - 36V DC; Value: TPP362081-T6TR; Design Item ID: IC/VREG/TPP362081/SOT23-6; Part Status: Production; RoHS Comliant: Yes; Type: DC/DC; ComponentLink1Description: Datasheet; ComponentLink1URL: https://static.3peak.com/res/doc/ds/Datasheet_TPP36208.pdf
U2 = CMP-017-0114: IC LOAD SWITCH SOT26 T&R 3K; MFR: Diodes Inc; Populate: Yes; REACFH SVCH: Unaffected; Temp Range, Ambient: -40 / +85 C; Voltage Range: -60 / +60 V; Temp Range, Junction: -40 / +150C; Value: AP74700QW6-7; MFR#: AP74700QW6-7; Case Package: SOT23-6; Design Item ID: IC/LSW/AP74700QW6-7/SOT23-6; Part Status: Production; RoHS Comliant: Yes; Type: LOAD SWITCH; ComponentLink1Description: Datasheet; ComponentLink1URL: https://www.diodes.com/assets/Datasheets/AP74700Q.pdf
Z1 = CMP-014-0007: TVS DIODE 30VWM 48.4VC DO214AB; MFR#: SMCJ30CA-TP; MFR: Micro Commercial Co; Temp Range: -55 / +150 C; Voltage, Clamping: 48.4V; Current: 31A; Design Item ID: TVSB/1500W/30V/SMCJ30CA/SMC; MFR2#: SMCJ30CA; Value: SMCJ30CA; Part Status: Production; MFR2: Littelfuse Inc.

## Sheet leds.SchDoc
size B; Address1: MILWAUKEE TOOL; Address2: 13135 W. Lisbon Rd.; Address3: Brookfield, WI 53005; SheetNumber: 1; SheetTotal: 1
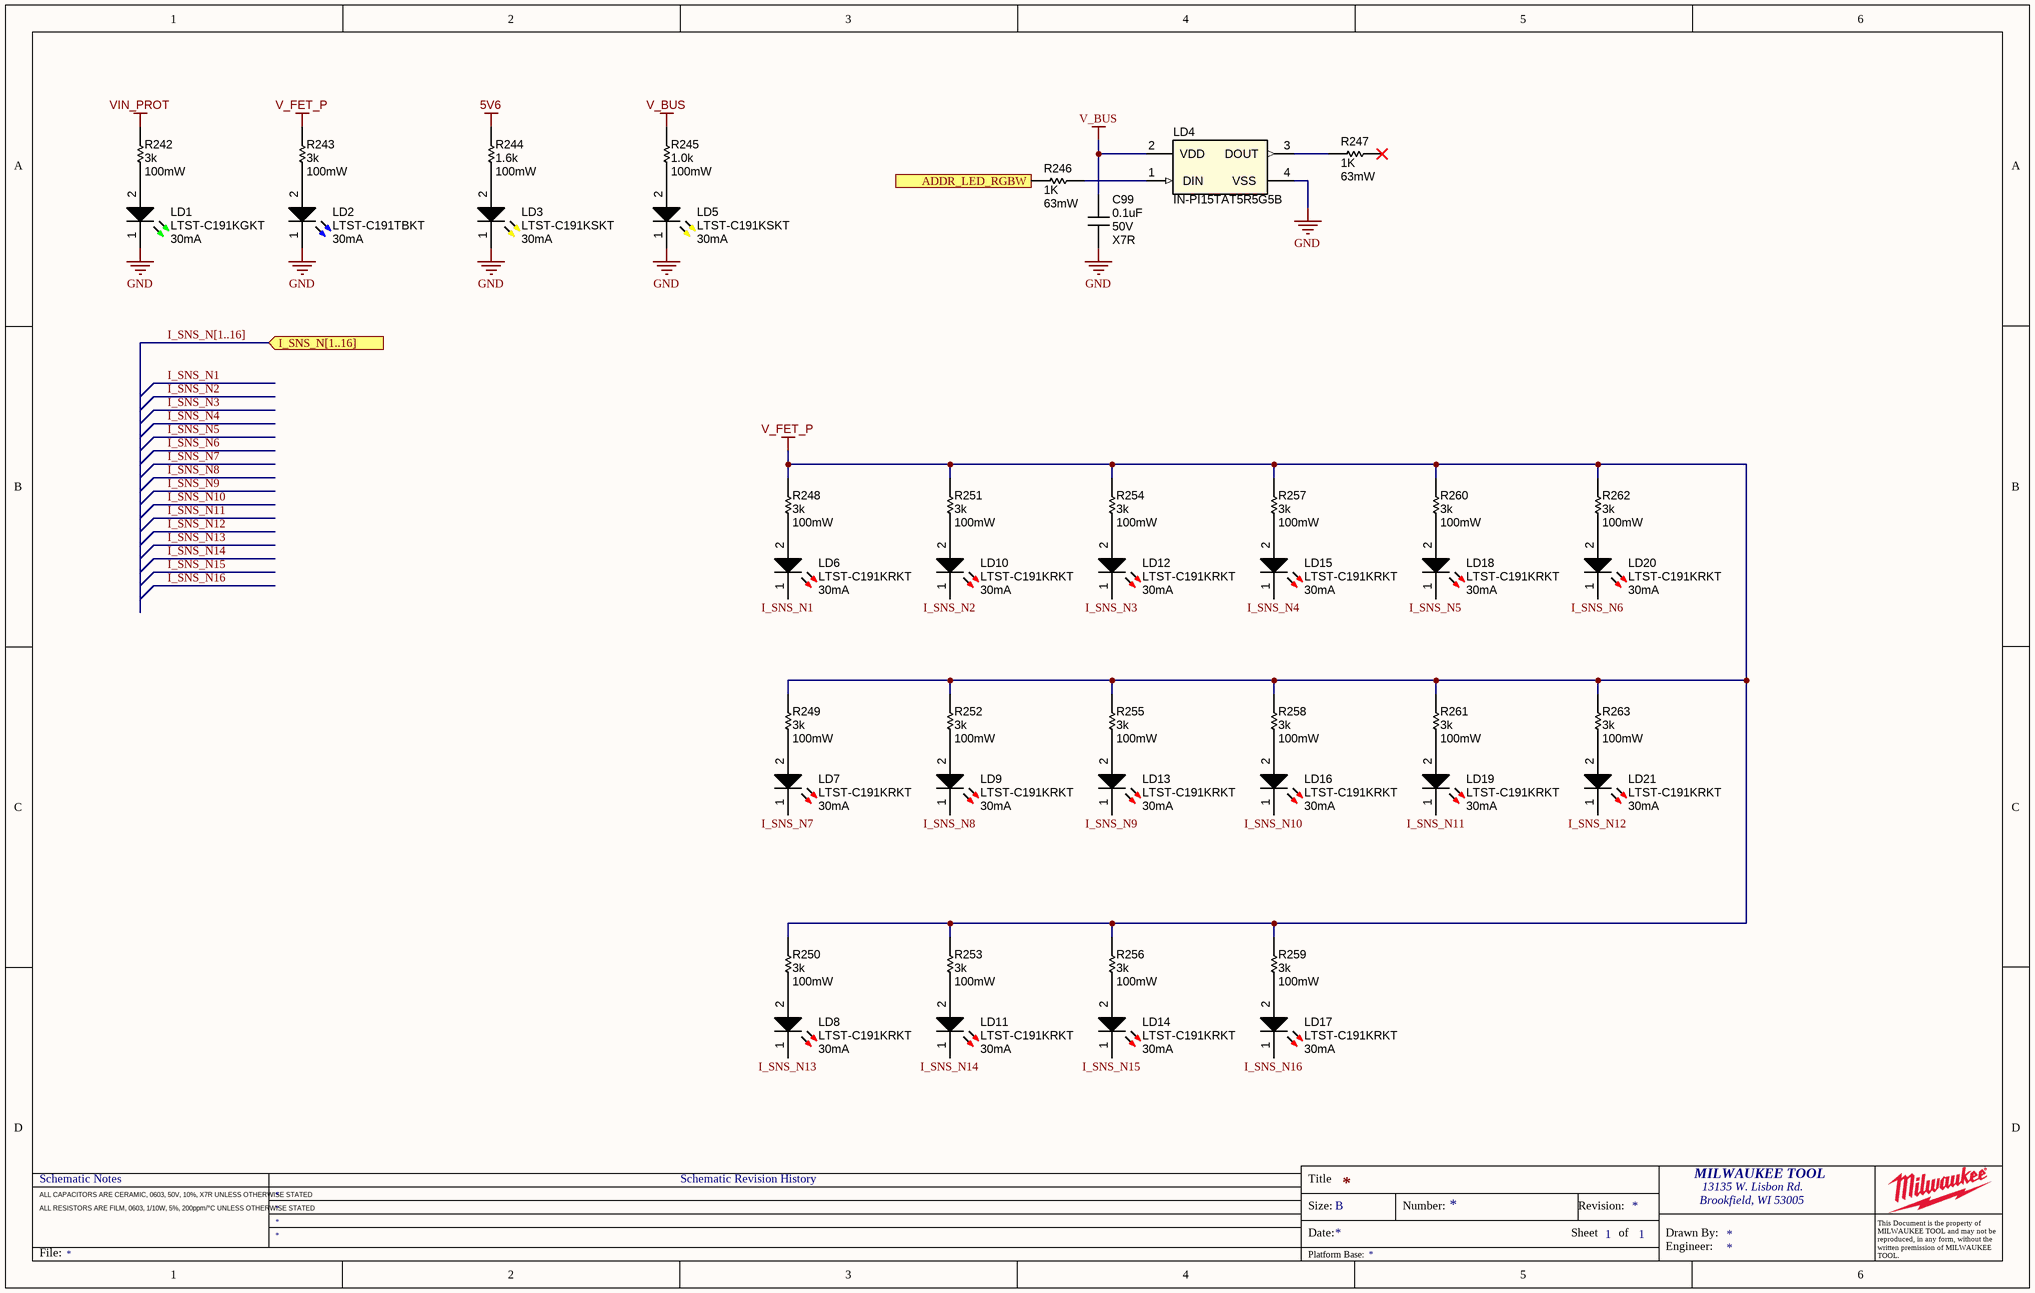
[diagram p3: leds.SchDoc]

### Parts
C99  0.1uF  Voltage Rating: 50V  Temp Coeff: X7R  [CAPC1005X06N]
LD1  LTST-C191KGKT  Current Rating: 30mA  [LED_0603_GREEN]
LD2  LTST-C191TBKT  Current Rating: 30mA  [LED_0603_BLUE]
LD3  LTST-C191KSKT  Current Rating: 30mA  [LED_0603_YELLOW]
LD4  IN-PI15TAT5R5G5B  [LED_INOLUX_IN-PI15TAT5R5G5B]
LD5  LTST-C191KSKT  Current Rating: 30mA  [LED_0603_YELLOW]
LD6  LTST-C191KRKT  Current Rating: 30mA  [LED_0603_RED]
LD7  LTST-C191KRKT  Current Rating: 30mA  [LED_0603_RED]
LD8  LTST-C191KRKT  Current Rating: 30mA  [LED_0603_RED]
LD9  LTST-C191KRKT  Current Rating: 30mA  [LED_0603_RED]
LD10  LTST-C191KRKT  Current Rating: 30mA  [LED_0603_RED]
LD11  LTST-C191KRKT  Current Rating: 30mA  [LED_0603_RED]
LD12  LTST-C191KRKT  Current Rating: 30mA  [LED_0603_RED]
LD13  LTST-C191KRKT  Current Rating: 30mA  [LED_0603_RED]
LD14  LTST-C191KRKT  Current Rating: 30mA  [LED_0603_RED]
LD15  LTST-C191KRKT  Current Rating: 30mA  [LED_0603_RED]
LD16  LTST-C191KRKT  Current Rating: 30mA  [LED_0603_RED]
LD17  LTST-C191KRKT  Current Rating: 30mA  [LED_0603_RED]
LD18  LTST-C191KRKT  Current Rating: 30mA  [LED_0603_RED]
LD19  LTST-C191KRKT  Current Rating: 30mA  [LED_0603_RED]
LD20  LTST-C191KRKT  Current Rating: 30mA  [LED_0603_RED]
LD21  LTST-C191KRKT  Current Rating: 30mA  [LED_0603_RED]
R242  3k  Wattage: 100mW  [RESC1608X06N]
R243  3k  Wattage: 100mW  [RESC1608X06N]
R244  1.6k  Wattage: 100mW  [RESC1608X06N]
R245  1.0k  Wattage: 100mW  [RESC1608X06N]
R246  1K  Wattage: 63mW  [RESC1005X04N]
R247  1K  Wattage: 63mW  [RESC1005X04N]
R248  3k  Wattage: 100mW  [RESC1608X06N]
R249  3k  Wattage: 100mW  [RESC1608X06N]
R250  3k  Wattage: 100mW  [RESC1608X06N]
R251  3k  Wattage: 100mW  [RESC1608X06N]
R252  3k  Wattage: 100mW  [RESC1608X06N]
R253  3k  Wattage: 100mW  [RESC1608X06N]
R254  3k  Wattage: 100mW  [RESC1608X06N]
R255  3k  Wattage: 100mW  [RESC1608X06N]
R256  3k  Wattage: 100mW  [RESC1608X06N]
R257  3k  Wattage: 100mW  [RESC1608X06N]
R258  3k  Wattage: 100mW  [RESC1608X06N]
R259  3k  Wattage: 100mW  [RESC1608X06N]
R260  3k  Wattage: 100mW  [RESC1608X06N]
R261  3k  Wattage: 100mW  [RESC1608X06N]
R262  3k  Wattage: 100mW  [RESC1608X06N]
R263  3k  Wattage: 100mW  [RESC1608X06N]

### Ports
ADDR_LED_RGBW (in), I_SNS_N[1..16] (in)

### Nets
5V6: R244.2
GND: C99.2 LD1.1(K) LD2.1(K) LD3.1(K) LD4.4(VSS) LD5.1(K)
V_BUS: C99.1 LD4.2(VDD) R245.2
V_FET_P: R243.2 R248.2 R249.2 R250.2 R251.2 R252.2 R253.2 R254.2 R255.2 R256.2 R257.2 R258.2 R259.2 R260.2 R261.2 R262.2 R263.2
VIN_PROT: R242.2
I_SNS_N1: LD6.1(K)
I_SNS_N2: LD10.1(K)
I_SNS_N3: LD12.1(K)
I_SNS_N4: LD15.1(K)
I_SNS_N5: LD18.1(K)
I_SNS_N6: LD20.1(K)
I_SNS_N7: LD7.1(K)
I_SNS_N8: LD9.1(K)
I_SNS_N9: LD13.1(K)
I_SNS_N10: LD16.1(K)
I_SNS_N11: LD19.1(K)
I_SNS_N12: LD21.1(K)
I_SNS_N13: LD8.1(K)
I_SNS_N14: LD11.1(K)
I_SNS_N15: LD14.1(K)
I_SNS_N16: LD17.1(K)
RGBW_LED: R246.1 ; port ADDR_LED_RGBW
NetLD1_2: LD1.2(A) R242.1
NetLD2_2: LD2.2(A) R243.1
NetLD3_2: LD3.2(A) R244.1
NetLD4_1: LD4.1(DIN) R246.2
NetLD4_3: LD4.3(DOUT) R247.1
NetLD5_2: LD5.2(A) R245.1
NetLD6_2: LD6.2(A) R248.1
NetLD7_2: LD7.2(A) R249.1
NetLD8_2: LD8.2(A) R250.1
NetLD9_2: LD9.2(A) R252.1
NetLD10_2: LD10.2(A) R251.1
NetLD11_2: LD11.2(A) R253.1
NetLD12_2: LD12.2(A) R254.1
NetLD13_2: LD13.2(A) R255.1
NetLD14_2: LD14.2(A) R256.1
NetLD15_2: LD15.2(A) R257.1
NetLD16_2: LD16.2(A) R258.1
NetLD17_2: LD17.2(A) R259.1
NetLD18_2: LD18.2(A) R260.1
NetLD19_2: LD19.2(A) R261.1
NetLD20_2: LD20.2(A) R262.1
NetLD21_2: LD21.2(A) R263.1

Not connected (* = marked no-connect by the designer): R247 2*

### Buses and harness runs
bus I_SNS_N[1..16] = port I_SNS_N[1..16]

### Notes on the sheet
- Schematic Notes
- Schematic Revision History
- Title
- ALL CAPACITORS ARE CERAMIC, 0603, 50V, 10%, X7R UNLESS OTHERWISE STATED
- ALL RESISTORS ARE FILM, 0603, 1/10W, 5%, 200ppm/°C UNLESS OTHERWISE STATED
- Size:
- Date:
- B
- Number:
- Sheet
- Revision:
- of
- Drawn By:
- Brookfield, WI 53005
- File:
- Platform Base:
- Engineer:
- This Document is the property of MILWAUKEE TOOL and may not be reproduced, in any form, without the written premission of MILWAUKEE TOOL.

### Library data of the parts
C99 = CMP-004-0076: as C2 on sheet Connectors; Case Code (Imperial): 0402; Value: 0.1uF; MFR4: Samsung Electro-Mechanics; Design Item ID: CN/0.1uF/50V/X7R/10%/0402; Case Code (Metric): 1005; ComponentLink1URL: https://search.murata.co.jp/Ceramy/image/img/A01X/G101/ENG/GRM155R71H104KE14-01.pdf; MFR3: KYOCERA AVX; MFR2: TDK Corporation; ComponentLink1Description: Datasheet; RoHS Compliant: Yes; Part Status: Production
LD1 = CMP-012-0014: LED GREEN CLEAR 0603 SMD; MFR: Lite-On Inc.; Wavelength: 567.5 - 576.5nm; Temp Range: -55 / +85 C; Wattage: 75mW; Viewing Angle: 120°; Voltage, Forward: 1.9 - 2.5V; Voltage, Reverse: 5V; Voltage: 2V; ComponentLink1URL: https://optoelectronics.liteon.com/upload/download/DS22-2000-228/LTST-C191KGKT.PDF; Value: LTST-C191KGKT; RoHS Compliant: Yes; Colour: Green; ComponentLink1Description: Datasheet; Design Item ID: LED/GREEN/30mA/LTST-C191KGKT/Lite-On/0603; MFR#: LTST-C191KGKT; Case/Package: 0603 (1608)
LD2 = CMP-012-0016: LED BLUE CLEAR 0603 SMD; MFR: Lite-On Inc.; Wavelength: 465 - 475nm; Temp Range: -55 / +85 C; Wattage: 75mW; Viewing Angle: 120°; Voltage, Forward: 1.9 - 2.5V; Voltage, Reverse: 5V; Voltage: 2V; ComponentLink1URL: https://optoelectronics.liteon.com/upload/download/DS22-2000-230/LTST-C191TBKT.pdf; Value: LTST-C191TBKT; RoHS Compliant: Yes; Colour: Blue; ComponentLink1Description: Datasheet; Design Item ID: LED/BLUE/30mA/LTST-C191TBKT/Lite-On/0603; MFR#: LTST-C191TBKT; Case/Package: 0603 (1608)
LD3 LD5 = CMP-012-0015: LED YELLOW CLEAR 0603 SMD; MFR: Lite-On Inc.; Wavelength: 584.5 - 597nm; Temp Range: -55 / +85 C; Wattage: 75mW; Viewing Angle: 120°; Voltage, Forward: 1.9 - 2.5V; Voltage, Reverse: 5V; Voltage: 2V; ComponentLink1URL: https://optoelectronics.liteon.com/upload/download/DS22-2000-224/LTST-C191KSKT.PDF; Value: LTST-C191KSKT; RoHS Compliant: Yes; Colour: Yellow; ComponentLink1Description: Datasheet; Design Item ID: LED/YLW/30mA/LTST-C191KSKT/Lite-On/0603; MFR#: LTST-C191KSKT; Case/Package: 0603 (1608)
LD4 = CMP-012-0023: LED ADDRESSABLE RGB 1.50mm x 1.50mm; MFR: Inolux; Viewing Angle: 130 degree; Colour: RGBW; Wavelength, Red: 620-630; Current, Reverse Leakage: 10uA; Temp Range: -30 / +85 C; Voltage, Forward: 3.5V - 5.5V; Current: 12mA; Interface: Shift Register; Wavelength, Green: 515-530; Wavelength, Blue: 460-470; Wavelength, White: 4000k; Clock: 800kHz; MFR#: IN-PI15TAT5R5G5B; Part Status: Production; Value: IN-PI15TAT5R5G5B; ComponentLink1Description: Datasheet; Design Item ID: LED/RGBW/IN-PI15TAT5R5G5B; Case/Package: 1515; ComponentLink1URL: https://www.inolux-corp.com/datasheet/SMDLED/Addressable%20LED/IN-PI55QATPRPGPBPW-XX_v1.3.pdf
LD6-LD21 = CMP-012-0013: LED RED CLEAR 0603 SMD; MFR: Lite-On Inc.; Wavelength: 625nm; Temp Range: -55 / +85 C; Wattage: 75mW; Viewing Angle: 120°; Voltage, Forward: 1.9 - 2.5V; Voltage, Reverse: 5V; Voltage: 2V; ComponentLink1URL: https://optoelectronics.liteon.com/upload/download/DS22-2000-223/LTST-C191KRKT.PDF; Value: LTST-C191KRKT; RoHS Compliant: Yes; Colour: Red; ComponentLink1Description: Datasheet; Design Item ID: LED/RED/30mA/LTST-C191KRKT/Lite-On/0603; MFR#: LTST-C191KRKT; Case/Package: 0603 (1608)
R242 R243 R248-R263 = CMP-025-0012: RES SMD 3K OHM 1% 1/10W 0603; MFR: Panasonic Electronic Components; MFR#: ERJ-3EKF3001V; MFR2#: RMCF0603FT3K00; Voltage Rating: 75V; Quality: AEC-Q200; Temperature Coefficient: 100ppm/°C; Current: 1A; Value: 3k ohm; Temp Range: -55 / +155 C; MFR2: Stackpole Electronics Inc; REACH SVHC: Yes; Tolerance: 1%; RoHS Compliant: Yes; Case Code (Imperial): 0603; Resistor Type: Thick Film; Case Code (Metric): 1608; ComponentLink1URL: https://industrial.panasonic.com/cdbs/www-data/pdf/RDA0000/AOA0000C304.pdf; ComponentLink1Description: Datasheet; Design Item ID: R/3K/0.1W/1%/0603
R244 = CMP-025-0060: RES SMD 1.6K OHM 1% 1/10W 0603; MFR2#: ERJ-3EKF1601V; MFR: Stackpole Electronics Inc; MFR#: RMCF0603FT1K60; MFR3#: RK73H1JTTD1601F; Voltage Rating: 75V; Quality: AEC-Q200; Temperature Coefficient: 100ppm/°C; Temp Range: -55 / +155 C; Current: 1A; MFR2: Panasonic; Case Code (Imperial): 0603; Resistor Type: Thick Film; ComponentLink1Description: Datasheet; REACH SVHC: Yes; Case Code (Metric): 1608; Value: 1.6k ohm; RoHS Compliant: Yes; MFR3: KOA Speer Electronics; ComponentLink1URL: https://www.yageo.com/upload/media/product/productsearch/datasheet/rchip/PYu-RC_Group_51_RoHS_L_11.pdf; Tolerance: 1%; Design Item ID: R/1.6K/0.1W/1%/0603
R245 = CMP-025-0097: RES SMD 1K OHM 1% 1/10W 0603; MFR: Panasonic Electronic Components; MFR3#: RC0603FR-071KL; MFR2#: RMCF0603FT1K00; MFR4#: CRCW06031K00FKEA; MFR#: ERJ-3EKF1001V; Quality: AEC-Q200; Voltage: 75V; Current: 1A; Temp Range: -55 / +155 C; Resistor Type: Thick Film; ComponentLink1Description: Datasheet; MFR3: Yageo; Value: 1k; Part Status: Production; ComponentLink1URL: https://industrial.panasonic.com/cdbs/www-data/pdf/RDA0000/AOA0000C304.pdf; Tolerance: 1%; MFR2: Stackpole Electronics Inc; Design Item ID: R/1.0K/0.1W/1%/0603; MFR4: Vishay
R246 R247 = CMP-025-0154: RES SMD 1K OHM 1% 1/16W 0402; MFR4#: CR0402-FX-1001GLF; MFR#: RMCF0402FT1K00; MFR: Stackpole Electronics Inc; MFR3#: CRCW04021K00FKED; MFR2#: RC0402FR-071KL; Value: 1k Ohm; Voltage Rating: 75V; Temp Range: -55 / +155 C; Current: 1A; Temperature Coefficient: 100ppm/°C; Populate: Yes; MFR2: YAGEO; Tolerance: 1%; MFR3: Vishay Dale; ComponentLink1Description: Datasheet; ComponentLink1URL: https://www.yageo.com/upload/media/product/products/datasheet/rchip/PYu-RC_Group_51_RoHS_L_12.pdf; Resistor Type: Thick Film; Case Code (Imperial): 0402; MFR4: Bourns Inc; Case Code (Metric): 1005; Design Item ID: R/1.0K/0.063W/1%/0402; RoHS Compliant: Yes

## Sheet i2c_mux.SchDoc
size B; Address1: MILWAUKEE TOOL; Address2: 13135 W. Lisbon Rd.; Address3: Brookfield, WI 53005; SheetNumber: 1; SheetTotal: 1
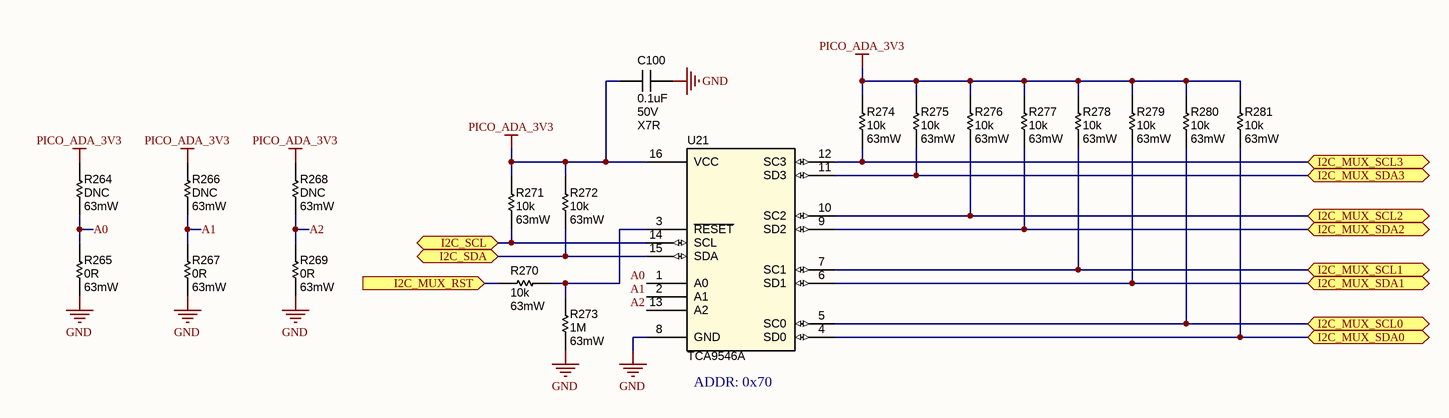
[diagram p4: i2c_mux.SchDoc]

### Parts
C100  0.1uF  Voltage Rating: 50V  Temp Coeff: X7R  [CAPC1005X06N]
R264  DNC  Wattage: 63mW  [RESC1005X04N]
R265  0R  Wattage: 63mW  [RESC1005X04N]
R266  DNC  Wattage: 63mW  [RESC1005X04N]
R267  0R  Wattage: 63mW  [RESC1005X04N]
R268  DNC  Wattage: 63mW  [RESC1005X04N]
R269  0R  Wattage: 63mW  [RESC1005X04N]
R270  10k  Wattage: 63mW  [RESC1005X04N]
R271  10k  Wattage: 63mW  [RESC1005X04N]
R272  10k  Wattage: 63mW  [RESC1005X04N]
R273  1M  Wattage: 63mW  [RESC1005X04N]
R274  10k  Wattage: 63mW  [RESC1005X04N]
R275  10k  Wattage: 63mW  [RESC1005X04N]
R276  10k  Wattage: 63mW  [RESC1005X04N]
R277  10k  Wattage: 63mW  [RESC1005X04N]
R278  10k  Wattage: 63mW  [RESC1005X04N]
R279  10k  Wattage: 63mW  [RESC1005X04N]
R280  10k  Wattage: 63mW  [RESC1005X04N]
R281  10k  Wattage: 63mW  [RESC1005X04N]
U21  TCA9546A  [SOP65P640X120-16N]

### Ports
I2C_MUX_RST (in), I2C_MUX_SCL0 (bidir), I2C_MUX_SCL1 (bidir), I2C_MUX_SCL2 (bidir), I2C_MUX_SCL3 (bidir), I2C_MUX_SDA0 (bidir), I2C_MUX_SDA1 (bidir), I2C_MUX_SDA2 (bidir), I2C_MUX_SDA3 (bidir), I2C_SCL (bidir), I2C_SDA (bidir)

### Nets
GND: C100.1 R265.1 R267.1 R269.1 R273.1 U21.8(GND)
PICO_ADA_3V3: C100.2 R264.2 R266.2 R268.2 R271.2 R272.2 R274.2 R275.2 R276.2 R277.2 R278.2 R279.2 R280.2 R281.2 U21.16(VCC)
A0: R264.1 R265.2 U21.1(A0)
A1: R266.1 R267.2 U21.2(A1)
A2: R268.1 R269.2 U21.13(A2)
I2C0_SCL: R271.1 U21.14(SCL) ; port I2C_SCL
I2C0_SDA: R272.1 U21.15(SDA) ; port I2C_SDA
I2C_MUX_RESET: R270.1 ; port I2C_MUX_RST
I2C_MUX_SCL0: R280.1 U21.5(SC0) ; port I2C_MUX_SCL0
I2C_MUX_SCL1: R278.1 U21.7(SC1) ; port I2C_MUX_SCL1
I2C_MUX_SCL2: R276.1 U21.10(SC2) ; port I2C_MUX_SCL2
I2C_MUX_SCL3: R274.1 U21.12(SC3) ; port I2C_MUX_SCL3
I2C_MUX_SDA0: R281.1 U21.4(SD0) ; port I2C_MUX_SDA0
I2C_MUX_SDA1: R279.1 U21.6(SD1) ; port I2C_MUX_SDA1
I2C_MUX_SDA2: R277.1 U21.9(SD2) ; port I2C_MUX_SDA2
I2C_MUX_SDA3: R275.1 U21.11(SD3) ; port I2C_MUX_SDA3
NetR270_2: R270.2 R273.2 U21.3(~{RESET})

### Notes on the sheet
- (near U21) ADDR: 0x70
- Schematic Notes
- Schematic Revision History
- Title
- ALL CAPACITORS ARE CERAMIC, 0603, 50V, 10%, X7R UNLESS OTHERWISE STATED
- ALL RESISTORS ARE FILM, 0603, 1/10W, 5%, 200ppm/°C UNLESS OTHERWISE STATED
- Size:
- Date:
- B
- Number:
- Sheet
- Revision:
- of
- Drawn By:
- Brookfield, WI 53005
- File:
- Platform Base:
- Engineer:
- This Document is the property of MILWAUKEE TOOL and may not be reproduced, in any form, without the written premission of MILWAUKEE TOOL.

### Library data of the parts
C100 = CMP-004-0076: as C2 on sheet Connectors; Case Code (Imperial): 0402; Value: 0.1uF; MFR4: Samsung Electro-Mechanics; Design Item ID: CN/0.1uF/50V/X7R/10%/0402; Case Code (Metric): 1005; ComponentLink1URL: https://search.murata.co.jp/Ceramy/image/img/A01X/G101/ENG/GRM155R71H104KE14-01.pdf; MFR3: KYOCERA AVX; MFR2: TDK Corporation; ComponentLink1Description: Datasheet; RoHS Compliant: Yes; Part Status: Production
R264-R269 = CMP-025-0102: RES SMD 0 OHM JUMPER 1/16W 0402; MFR3#: CRCW04020000Z0ED; MFR: Stackpole Electronics Inc; MFR2#: AC0402JR-070RL; MFR4#: RS-02K000JT; MFR#: RMCF0402ZT0R00; Value: 0 ohm; Quality: AEC-Q200; Voltage Rating: 50V; Current: 1A; Temp Range: -55 / +155 C; Case Code (Metric): 1002; Case Code (Imperial): 0402; MFR2: YAGEO; Design Item ID: R/0.00/0.063W/JUMPER/0402; MFR4: FengHua; Resistor Type: Thick Film; ClassName: Fine_Pitch; MFR3: Vishay Dale; Tolerance: Jumper; REACH SVHC: Yes; RoHS Compliant: Yes
R270-R272 R274-R281 = CMP-025-0026: as R282 on sheet Connectors; MFR2: Stackpole Electronics Inc; RoHS Compliant: Yes; ComponentLink1Description: Datasheet; REACH SVHC: Yes; Value: 10k; Case Code (Imperial): 0402; Case Code (Metric): 1005; Tolerance: 0.5%; Resistor Type: Thick Film; Design Item ID: R/10.0K/0.063W/0.5%/0402; ComponentLink1URL: https://industrial.panasonic.com/cdbs/www-data/pdf/RDM0000/AOA0000C307.pdf
R273 = CMP-025-0173: RES SMD 1M OHM 1% 1/16W 0402; MFR#: RC0402FR-071ML; MFR: YAGEO; Value: 1M Ohm; Temp Range: -55 / +155 C; Temperature Coefficient: 100ppm/°C; Populate: Yes; Tolerance: 1%; ComponentLink1Description: Datasheet; ComponentLink1URL: https://yageogroup.com/content/datasheet/asset/file/PYU-RC_GROUP_51_ROHS_L; Resistor Type: Thick Film; Case Code (Imperial): 0402; Case Code (Metric): 1005; Design Item ID: R/1.0M/0.063W/1%/0402; RoHS Compliant: Yes; Part Status: Production
U21 = CMP-017-0074: IC BUS SWITCH 2 X 1:4 16TSSOP; MFR: Texas Instruments; MFR#: TCA9546APWR; Temp Range: -40 / +150 C; Value: TCA9546APWR; Current, Operating: 14uA; Voltage Range: 1.65V - 5.5V DC; Populate: Yes; Rth(j-c): 56.6 C/W; Rth(j-a): 122.3 C/W; Current, Quiescent: 1.3uA; ComponentLink1Description: Datasheet; REACH SVHC: Unaffected; ClassName: FinePitch; Case/Package: TSSOP16; Type: I2C Multiplexer; Part Status: Production; ComponentLink1URL: https://www.ti.com/general/docs/suppproductinfo.tsp?distId=10&gotoUrl=https%3A%2F%2Fwww.ti.com%2Flit%2Fgpn%2Ftca9546a; RoHS Compliant: Yes; Design Item ID: IC/SW/TCA9546APWR/TSSOP16; ComponentLink2URL: https://www.ti.com/product/TCA9546A#product-details; ComponentLink2Description: Product Page